# EasyEDA schematic 1-Schematic_STM32F103RCCoreBoard.json
TITLE: KiDingPi_鸡丁派; REV: 1.0; Date: 2025-05-01; Sheet: 1/1; Drawn By: wnqs0628; Company: @BRAIL_INC
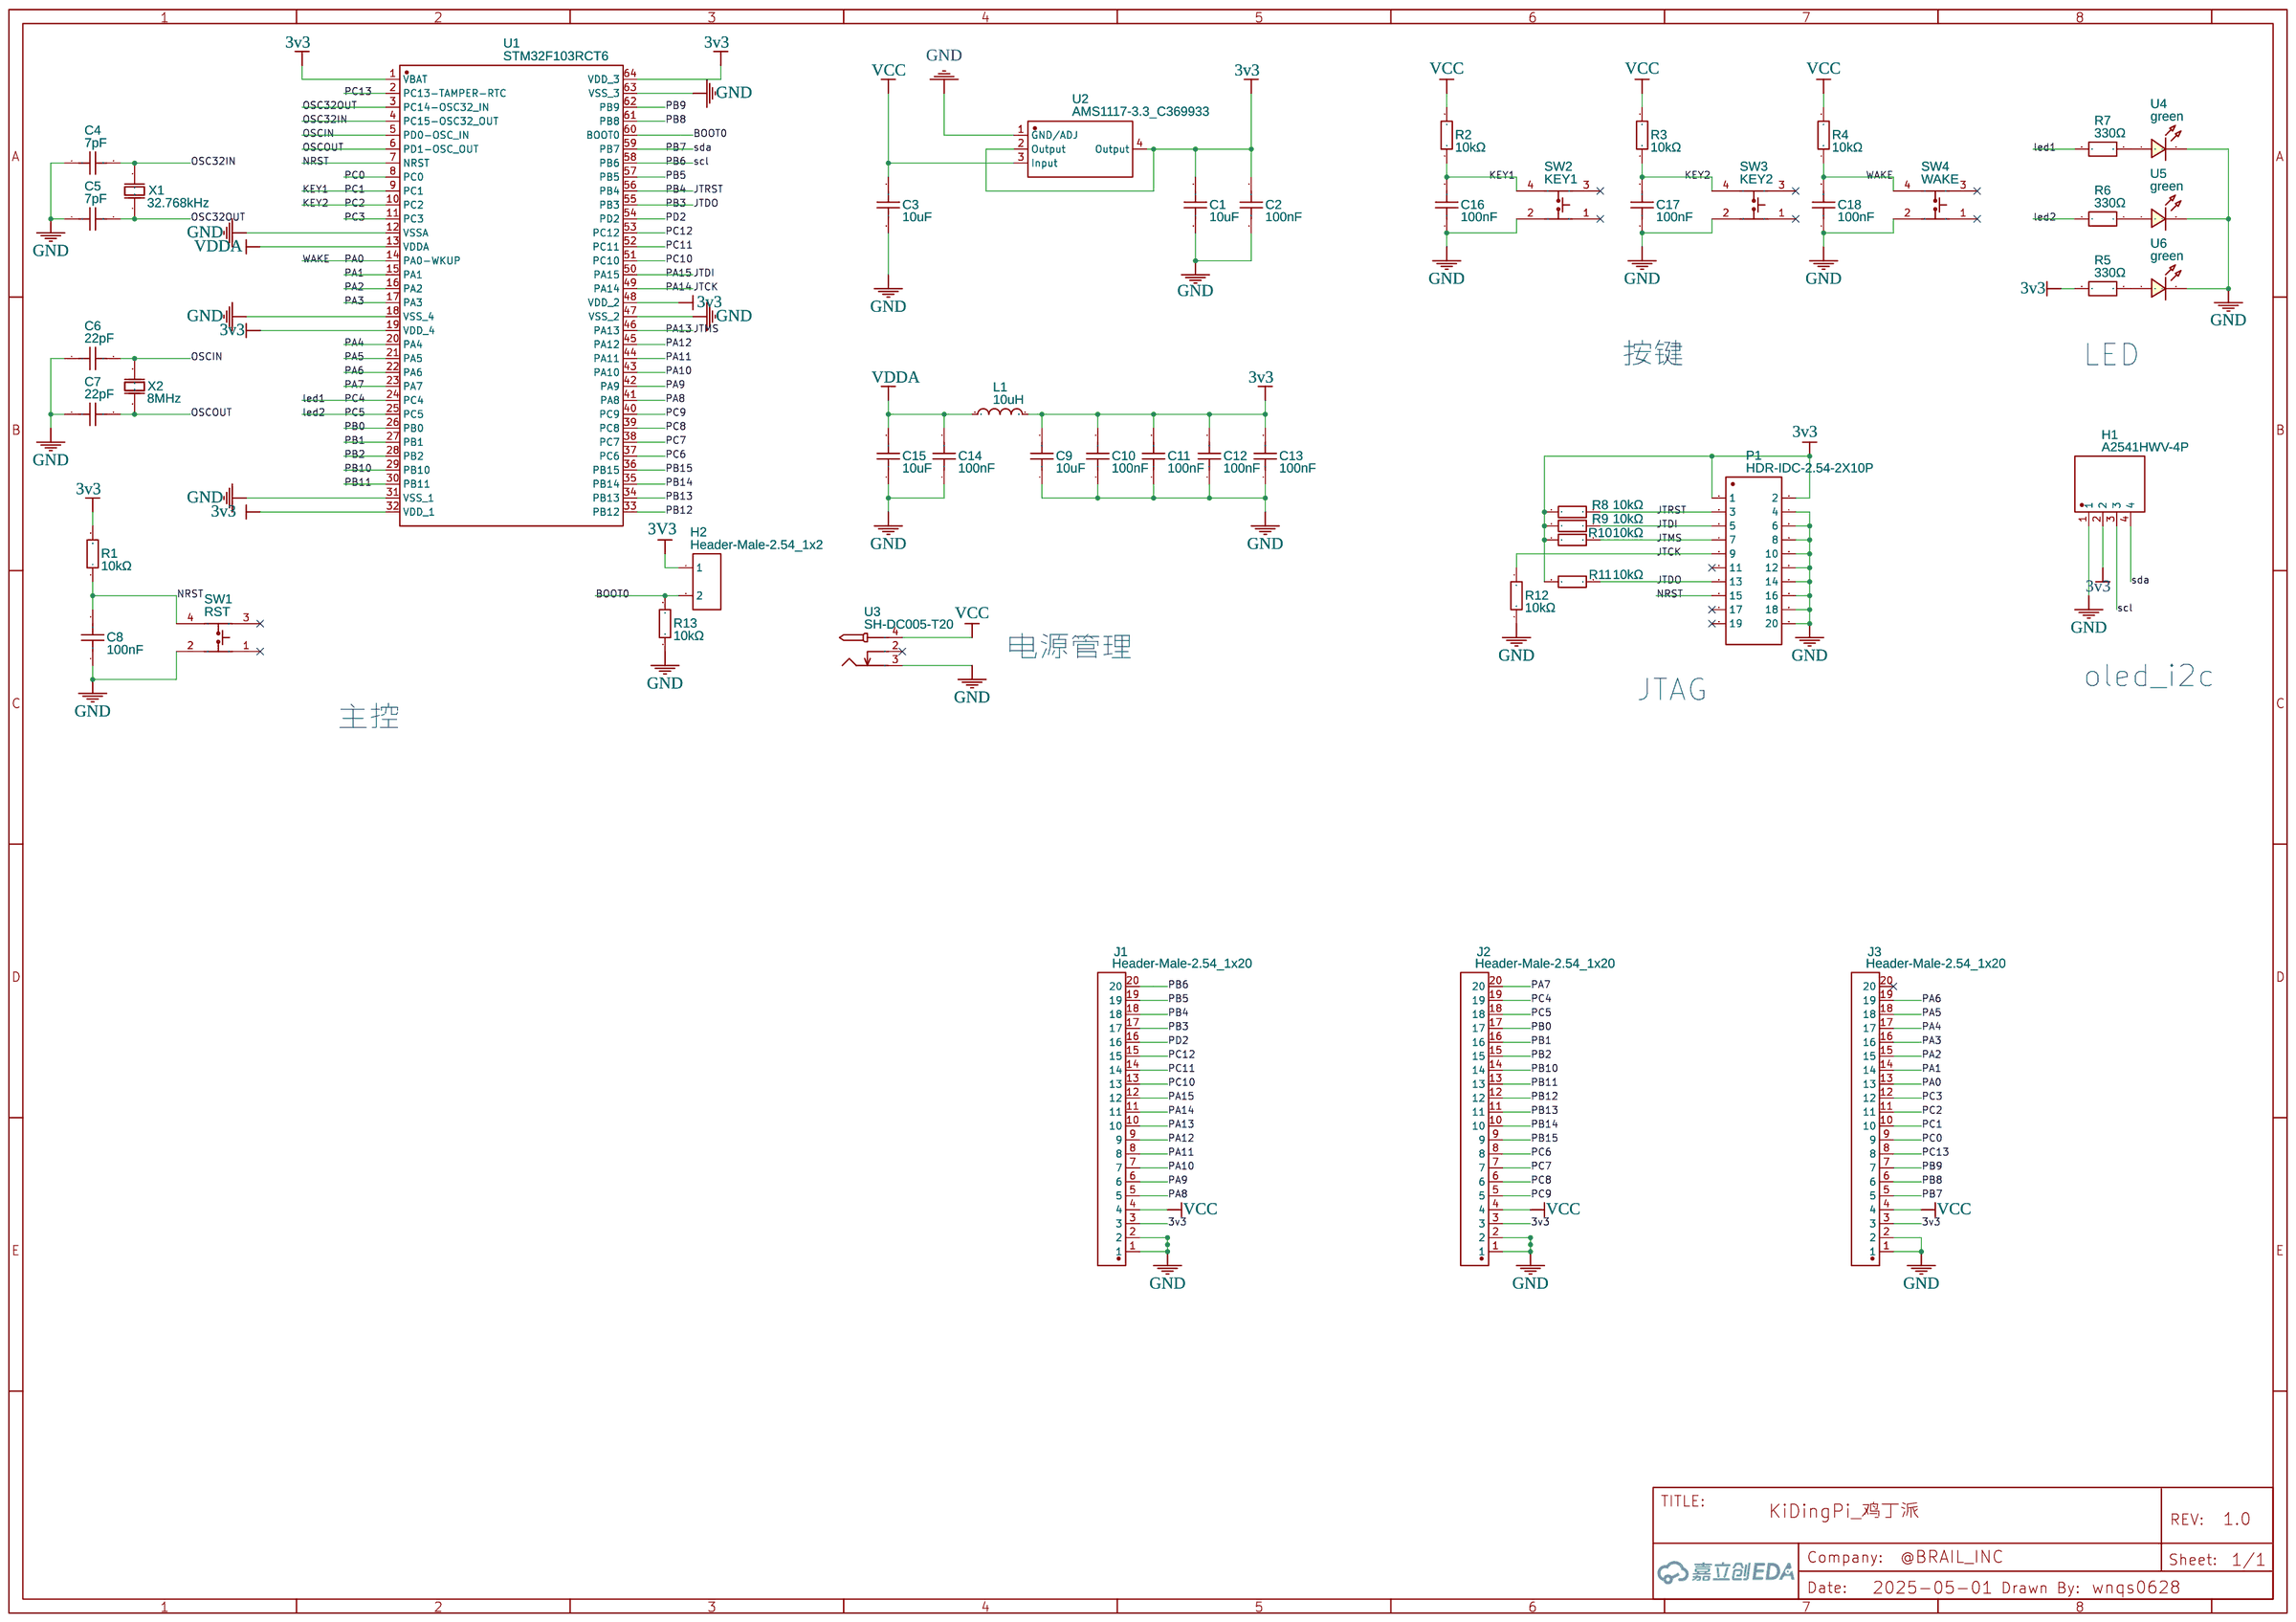
[diagram p0: schematic sheet]

## Parts
C1  10uF  [C0603]
C2  100nF  [C0603]
C3  10uF  [C0603]
C4  7pF  [C0603]
C5  7pF  [C0603]
C6  22pF  [C0603]
C7  22pF  [C0603]
C8  100nF  [C0603]
C9  10uF  [C0603]
C10  100nF  [C0603]
C11  100nF  [C0603]
C12  100nF  [C0603]
C13  100nF  [C0603]
C14  100nF  [C0603]
C15  10uF  [C0603]
C16  100nF  [C0603]
C17  100nF  [C0603]
C18  100nF  [C0603]
H1  A2541HWV-4P  [HDR-TH_4P-P2.54-V_A2541HWV-4P]
H2  Header-Male-2.54_1x2  [HDR-TH_2P-P2.54-V-M-1]
J1  Header-Male-2.54_1x20  [HDR-TH_20P-P2.54-V-M-1]
J2  Header-Male-2.54_1x20  [HDR-TH_20P-P2.54-V-M-1]
J3  Header-Male-2.54_1x20  [HDR-TH_20P-P2.54-V-M-1]
L1  10uH  [IND-SMD_L3.0-W3.0_SWPA3010S]
P1  HDR-IDC-2.54-2X10P  [IDC-TH_20P-P2.54-V-R2-C10-S2.54]
R1  10kΩ  [R0603]
R2  10kΩ  [R0603]
R3  10kΩ  [R0603]
R4  10kΩ  [R0603]
R5  330Ω  [R0603]
R6  330Ω  [R0603]
R7  330Ω  [R0603]
R8  10kΩ  [R0603]
R9  10kΩ  [R0603]
R10  10kΩ  [R0603]
R11  10kΩ  [R0603]
R12  10kΩ  [R0603]
R13  10kΩ  [R0603]
SW1  RST  [SW-SMD_4P-L4.2-W3.2-P2.15-LS4.6]
SW2  KEY1  [SW-SMD_4P-L4.2-W3.2-P2.15-LS4.6]
SW3  KEY2  [SW-SMD_4P-L4.2-W3.2-P2.15-LS4.6]
SW4  WAKE  [SW-SMD_4P-L4.2-W3.2-P2.15-LS4.6]
U1  STM32F103RCT6  [LQFP-64_L10.0-W10.0-P0.50-LS12.0-BL]
U2  AMS1117-3.3_C369933  [SOT-223-4_L6.5-W3.5-P2.30-LS7.0-BR]
U3  SH-DC005-T20  [DC-IN-TH_SH-DC005-T20]
U4  green  [LED0603-FD]
U5  green  [LED0603-FD]
U6  green  [LED0603-FD]
X1  32.768kHz  [OSC-SMD_2P-L3.2-W1.5]
X2  8MHz  [CRYSTAL-SMD_L5.0-W3.2]

## Library data of the parts
C1 C3 C9 C15 = TCC0603X5R106M6R3CT: Contributor: LCSC; Supplier: LCSC; Supplier Part: C380318; Manufacturer: CCTC(三环); JLCPCB Part Class: Extended Part
C2 C10-C14 C16-C18 = TCC0603X7R104M500CT: Contributor: LCSC; Supplier: LCSC; Supplier Part: C282670; Manufacturer: CCTC(三环); JLCPCB Part Class: Extended Part
C4 C5 = GRM1885C1H7R0BA01D: Contributor: LCSC; Supplier: LCSC; Supplier Part: C162246; Manufacturer: muRata(村田); JLCPCB Part Class: Extended Part
C6 C7 = TCC0603COG220K500CT: Supplier: LCSC; Supplier Part: C5360783; Manufacturer: CCTC(三环); JLCPCB Part Class: Extended Part; Contributor: lcsc
C8 = TCC0603Y5V104M500CT: Contributor: LCSC; Supplier: LCSC; Supplier Part: C376851; Manufacturer: CCTC(三环); JLCPCB Part Class: Extended Part
H1 = A2541HWV-4P: Contributor: LCSC; Supplier: LCSC; Supplier Part: C225501; Manufacturer: CJT(长江连接器); JLCPCB Part Class: Extended Part
H2 = Header-Male-2.54_1x2: Supplier: LCSC; Manufacturer: TE Connectivity(泰科电子); Manufacturer Part: 826629-2; Supplier Part: C86471; JLCPCB Part Class: Extended Part
J1-J3 = Header-Male-2.54_1x20: Supplier: LCSC; Manufacturer: BOOMELE(博穆精密); Manufacturer Part: 2.54-1*20P直针; Supplier Part: C50981; JLCPCB Part Class: Extended Part
L1 = SFE3015A-100M-F-HF: Supplier: LCSC; Supplier Part: C5159664; Manufacturer: DDY(德立); JLCPCB Part Class: Extended Part; Contributor: lcsc
P1 = HDR-IDC-2.54-2X10P: Supplier: LCSC; Manufacturer: BOOMELE(博穆精密); Manufacturer Part: 2.54-2*10P简牛; Supplier Part: C3405; JLCPCB Part Class: Extended Part
R1-R4 R8-R13 = RC0603JR-0710KL: Supplier: LCSC; Manufacturer: YAGEO(国巨); Supplier Part: C99198; JLCPCB Part Class: Extended Part
R5-R7 = TC0325B3300T5F: Supplier: LCSC; Supplier Part: C2989271; Manufacturer: UNI-ROYAL(厚声); JLCPCB Part Class: Extended Part; Contributor: lcsc
SW1-SW4 = YTS1T0161AWJ00: Contributor: LCSC; Supplier: LCSC; Supplier Part: C2985732; Manufacturer: YIYUAN(怡远)
U1 = STM32F103RCT6: Supplier: LCSC; Manufacturer: ST(意法半导体); Supplier Part: C8323; JLCPCB Part Class: Extended Part
U2 = AMS1117-3.3_C369933: Contributor: LCSC; Supplier: LCSC; Supplier Part: C369933; Manufacturer: KEXIN(科信); Manufacturer Part: AMS1117-3.3; JLCPCB Part Class: Extended Part
U3 = SH-DC005-T20: Supplier: LCSC; Supplier Part: C22383474; Manufacturer: SHOU HAN(首韩); JLCPCB Part Class: Extended Part; Contributor: lcsc
U4-U6 = 翠绿色高亮 W0603UG-0.6T: Supplier: LCSC; Supplier Part: C9900027177; Manufacturer: null; JLCPCB Part Class: Extended Part; Contributor: lcsc
X1 = XKXEL89CLI-SUAYLC-32.768K: Supplier: LCSC; Supplier Part: C17179430; Manufacturer: YXC(扬兴晶振); Contributor: lcsc; JLCPCB Part Class: Extended Part
X2 = X50328MSD2GC_C172361: Contributor: LCSC; Supplier: LCSC; Supplier Part: C172361; Manufacturer: YXC(扬兴晶振); Manufacturer Part: X50328MSD2GC; JLCPCB Part Class: Extended Part

## Nets
3v3: C1.2 C2.2 C9.2 C10.2 C11.2 C12.2 C13.2 H1.2 J1.3 J2.3 J3.3 L1.2 P1.1 P1.2 R1.2 R5.2 R8.2 R9.2 R10.2 R11.2 U1.1(VBAT) U1.19(VDD_4) U1.32(VDD_1) U1.48(VDD_2) U1.64(VDD_3) U2.2(Output) U2.4(Output)
3V3: H2.1
GND: C1.1 C2.1 C3.1 C4.1 C5.1 C6.1 C7.1 C8.1 C9.1 C10.1 C11.1 C12.1 C13.1 C14.1 C15.1 C16.1 C17.1 C18.1 H1.1 J1.1 J1.2 J2.1 J2.2 J3.1 J3.2 P1.4 P1.6 P1.8 P1.10 P1.12 P1.14 P1.16 P1.18 P1.20 R12.2 R13.1 SW1.2 SW2.2 SW3.2 SW4.2 U1.12(VSSA) U1.18(VSS_4) U1.31(VSS_1) U1.47(VSS_2) U1.63(VSS_3) U2.1(GND/ADJ) U3.3 U4.2(-) U5.2(-) U6.2(-)
VCC: C3.2 J1.4 J2.4 J3.4 R2.2 R3.2 R4.2 U2.3(Input) U3.4
VDDA: C14.2 C15.2 L1.1 U1.13(VDDA)
BOOT0: H2.2 R13.2 U1.60(BOOT0)
JTCK: J1.11 P1.9 R12.1 U1.49(PA14)
JTDI: J1.12 P1.5 R9.1 U1.50(PA15)
JTDO: J1.17 P1.13 R11.1 U1.55(PB3)
JTMS: J1.10 P1.7 R10.1 U1.46(PA13)
JTRST: J1.18 P1.3 R8.1 U1.56(PB4)
KEY1: C16.2 J3.10 R2.1 SW2.4 U1.9(PC1)
KEY2: C17.2 J3.11 R3.1 SW3.4 U1.10(PC2)
NRST: C8.2 P1.15 R1.1 SW1.4 U1.7(NRST)
OSC32IN: C4.2 U1.4(PC15-OSC32_OUT) X1.2(OSC2)
OSC32OUT: C5.2 U1.3(PC14-OSC32_IN) X1.1(OSC1)
OSCIN: C6.2 U1.5(PD0-OSC_IN) X2.2(OSC2)
OSCOUT: C7.2 U1.6(PD1-OSC_OUT) X2.1(OSC1)
PA0: C18.2 J3.13 R4.1 SW4.4 U1.14(PA0-WKUP)
PA1: J3.14 U1.15(PA1)
PA2: J3.15 U1.16(PA2)
PA3: J3.16 U1.17(PA3)
PA4: J3.17 U1.20(PA4)
PA5: J3.18 U1.21(PA5)
PA6: J3.19 U1.22(PA6)
PA7: J2.20 U1.23(PA7)
PA8: J1.5 U1.41(PA8)
PA9: J1.6 U1.42(PA9)
PA10: J1.7 U1.43(PA10)
PA11: J1.8 U1.44(PA11)
PA12: J1.9 U1.45(PA12)
PB0: J2.17 U1.26(PB0)
PB1: J2.16 U1.27(PB1)
PB2: J2.15 U1.28(PB2)
PB5: J1.19 U1.57(PB5)
PB6: H1.3 J1.20 U1.58(PB6)
PB7: H1.4 J3.5 U1.59(PB7)
PB8: J3.6 U1.61(PB8)
PB9: J3.7 U1.62(PB9)
PB10: J2.14 U1.29(PB10)
PB11: J2.13 U1.30(PB11)
PB12: J2.12 U1.33(PB12)
PB13: J2.11 U1.34(PB13)
PB14: J2.10 U1.35(PB14)
PB15: J2.9 U1.36(PB15)
PC0: J3.9 U1.8(PC0)
PC3: J3.12 U1.11(PC3)
PC4: J2.19 R7.2 U1.24(PC4)
PC5: J2.18 R6.2 U1.25(PC5)
PC6: J2.8 U1.37(PC6)
PC7: J2.7 U1.38(PC7)
PC8: J2.6 U1.39(PC8)
PC9: J2.5 U1.40(PC9)
PC10: J1.13 U1.51(PC10)
PC11: J1.14 U1.52(PC11)
PC12: J1.15 U1.53(PC12)
PC13: J3.8 U1.2(PC13-TAMPER-RTC)
PD2: J1.16 U1.54(PD2)
Net-(R5-1): R5.1 U6.1(+)
Net-(R6-1): R6.1 U5.1(+)
Net-(R7-1): R7.1 U4.1(+)

Not connected (* = marked no-connect by the designer): J3 20*; P1 11* 17* 19*; SW1 1* 3*; SW2 1* 3*; SW3 1* 3*; SW4 1* 3*; U3 2*

## Notes on the sheet
- 按键
- LED
- 电源管理
- oled_i2c
- JTAG
- 主控
